# EAGLE schematic serialmultiplex (EAGLE 6.4)
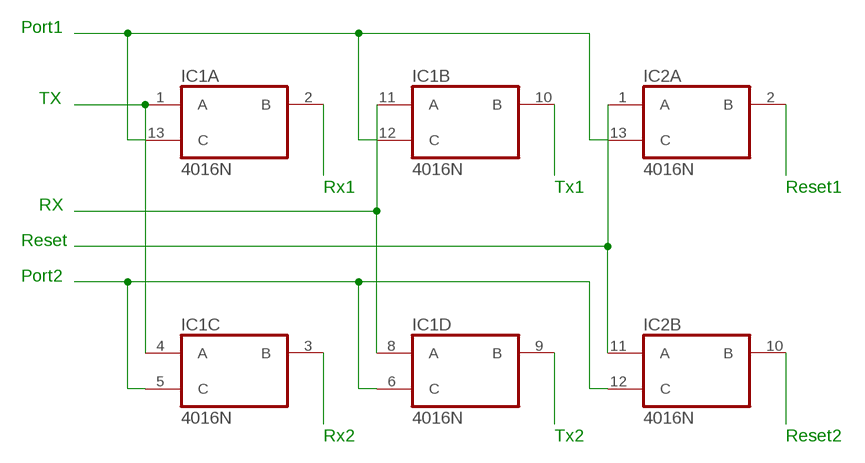
[diagram p0: schematic, sheet 1]

## Parts
IC1  4016N  [DIL14]
IC2  4016N  [DIL14]

## Nets
N$1: IC1.8(D:A) IC1.11(B:A)
N$2: IC2.1(A:A) IC2.11(B:A)
N$3: IC1.2(A:B)
N$4: IC1.12(B:C) IC1.13(A:C) IC2.13(A:C)
N$6: IC1.10(B:B)
N$7: IC1.5(C:C) IC1.6(D:C) IC2.12(B:C)
N$8: IC1.1(A:A) IC1.4(C:A)
N$9: IC1.3(C:B)
N$12: IC1.9(D:B)
N$15: IC2.2(A:B)
N$18: IC2.10(B:B)
Unconnected: IC2.3(C:B) IC2.4(C:A) IC2.5(C:C) IC2.6(D:C) IC2.8(D:A) IC2.9(D:B)

## Notes on the sheet
- Port1
- TX
- Rx1 | Tx1 | Reset1
- RX
- Reset
- Port2
- Rx2 | Tx2 | Reset2

## Power pins joined to a net without a drawn wire
VDD: IC1.14(P:VDD) IC2.14(P:VDD)
VSS: IC1.7(P:VSS) IC2.7(P:VSS)

## Library data of the parts
IC1 IC2 = 40xx:4016: Quad bilateral ANALOG SWITCH